# Altium schematic sheet DSO_RAM.SchDoc: Schematic_Name
size A4; CompanyName: University of Melbourne; Engineer: Your Name Here; DocumentNumber: 1; Revision: 0.1; SheetNumber: 1; SheetTotal: 1; Title_Project: Project_Title; StudentNo: Student No.
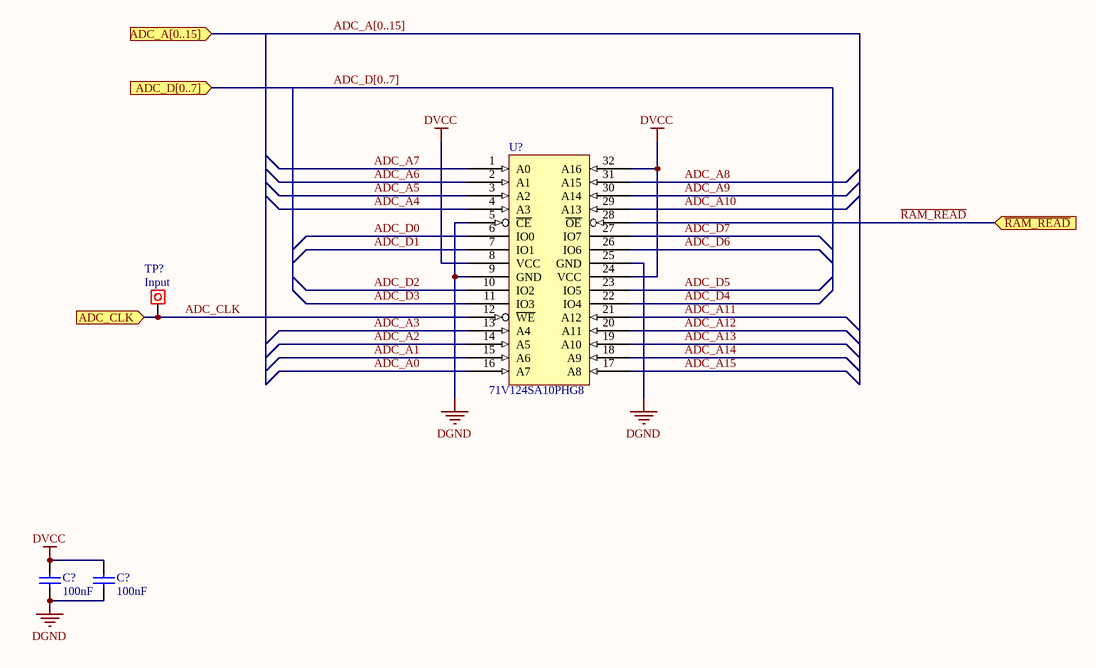
[diagram p0: DSO_RAM.SchDoc]

## Parts
(Parts that share a designator on the sheet are numbered #1, #2 ... from top to bottom, then left to right.)
C?#1  100nF  [0805C]
C?#2  100nF  [0805C]
TP?  INPUT  [Testpoin]
U?  71V124SA10PHG8  [TSOP-32]

## Ports
ADC_A[0..15] (in), ADC_CLK (in), ADC_D[0..7] (in), ~{RAM_READ} (in)

## Nets
DGND: C?#1.2 C?#2.2 U?.5(~{CE}) U?.9(GND) U?.25(GND)
DVCC: C?#1.1 C?#2.1 U?.8(VCC) U?.24(VCC) U?.32(A16)
ADC_A0: U?.16(A7)
ADC_A1: U?.15(A6)
ADC_A2: U?.14(A5)
ADC_A3: U?.13(A4)
ADC_A4: U?.4(A3)
ADC_A5: U?.3(A2)
ADC_A6: U?.2(A1)
ADC_A7: U?.1(A0)
ADC_A8: U?.31(A15)
ADC_A9: U?.30(A14)
ADC_A10: U?.29(A13)
ADC_A11: U?.21(A12)
ADC_A12: U?.20(A11)
ADC_A13: U?.19(A10)
ADC_A14: U?.18(A9)
ADC_A15: U?.17(A8)
ADC_CLK: TP?.1 U?.12(~{WE}) ; port ADC_CLK
ADC_D0: U?.6(IO0)
ADC_D1: U?.7(IO1)
ADC_D2: U?.10(IO2)
ADC_D3: U?.11(IO3)
ADC_D4: U?.22(IO4)
ADC_D5: U?.23(IO5)
ADC_D6: U?.26(IO6)
ADC_D7: U?.27(IO7)
~{RAM_READ}: U?.28(~{OE}) ; port ~{RAM_READ}

## Buses and harness runs
bus ADC_A[0..15] = port ADC_A[0..15]
bus ADC_D[0..7] = port ADC_D[0..7]

## Library data of the parts
C?#1 C?#2 = C: Capacitor; Reviewed by: RM - 2018/08/05; Revision: July-2002: Re-released for DXP Platform.; Value: 100nF; Supplier 1: *; Supplier Part Number 1: *
TP? = Test Point: Pad; Value: Input
U? = CY7C1019D: SRAM 128k x 8; Reviewed by: RM - 2018/08/05; Supplier 1: Digi-Key; Supplier Part Number 1: 428-1967-ND